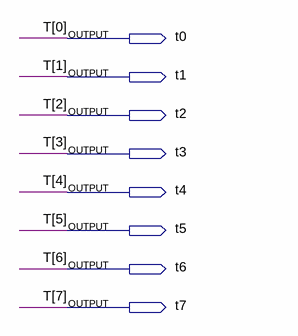
[diagram p0: schematic sheet]
// Quartus schematic backup.bdf as structural Verilog: 0 symbols, 8 pins
module backup (
  output t0,
  output t1,
  output t2,
  output t3,
  output t4,
  output t5,
  output t6,
  output t7
);
endmodule
